# Altium schematic sheet PowerDelivery.SchDoc: PPS, 2.9V rail, U/I sensing
size A4; SheetNumber: 2; SheetTotal: 2
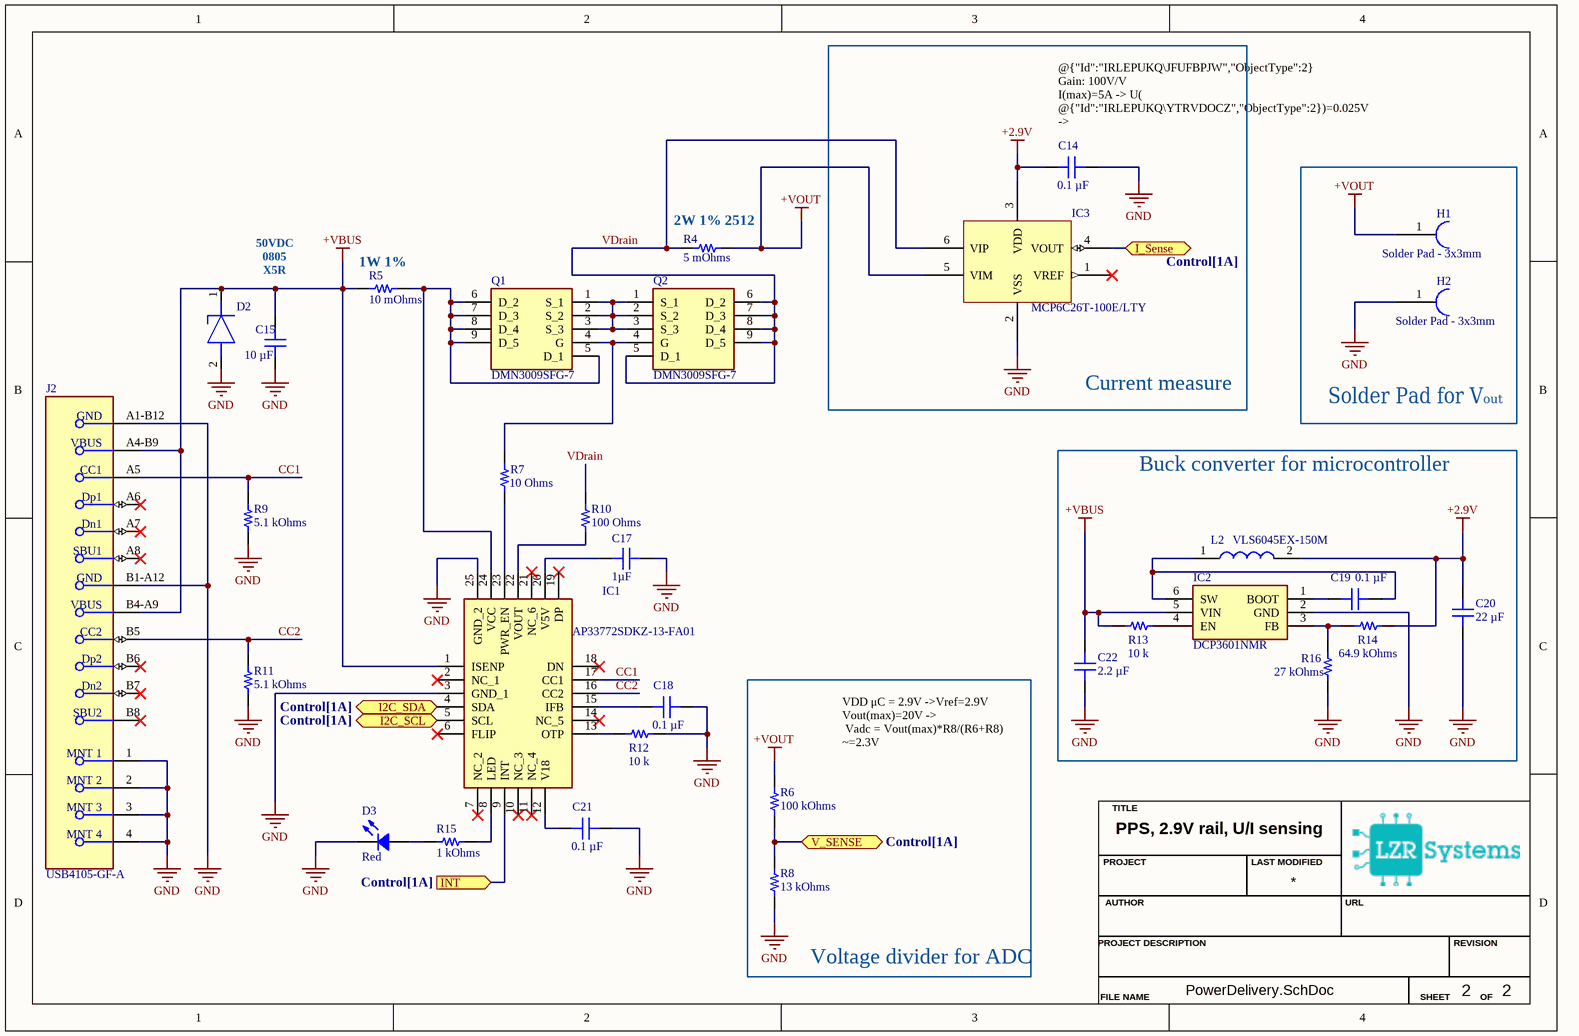
[diagram p0: PowerDelivery.SchDoc]

## Parts
C14  0.1 µF  [CAP 0805_2012]
C15  10 µF  [MURATA GRM21B 0805_2012]
C17  1µF  [CAP 0805_2012]
C18  0.1 µF  [CAP 0805_2012]
C19  0.1 µF  [CAP 0805_2012]
C20  22 µF  [CAP 1206_3216 - 0.8MM]
C21  0.1 µF  [CAP 0805_2012]
C22  2.2 µF  [CAP 1206_3216 - 0.8MM]
D2  PESD24VS1UA,115  [SOD2512X110N]  (value not drawn)
D3  Red  [LED 1206_3216 RED]
H1  Solder Pad - 3x3mm  [Solder Pad - 3x3mm-Footprint-1]
H2  Solder Pad - 3x3mm  [Solder Pad - 3x3mm-Footprint-1]
IC1  AP33772SDKZ-13-FA01  [AP33772SDKZ13FA01]
IC2  DCP3601NMR  [SOT95P280X125-6N]
IC3  MCP6C26T-100E/LTY  [SOT65P210X80-6N]
J2  USB4105-GF-A  [FP-USB4105-GF-A-MFG]
L2  VLS6045EX-150M  [VLS6045]
Q1  DMN3009SFG-7  [DMTH8008LFGQ7]
Q2  DMN3009SFG-7  [DMTH8008LFGQ7]
R4  5 mOhms  [STACKPOLE CSM2512]
R5  10 mOhms  [RES 1206_3216]
R6  100 kOhms  [RES 0805_2012]
R7  10 Ohms  [RES 0805_2012]
R8  13 kOhms  [RES 0805_2012]
R9  5.1 kOhms  [YAGEO RES 0805_2012]
R10  100 Ohms  [RES 0805_2012]
R11  5.1 kOhms  [YAGEO RES 0805_2012]
R12  10 k  [RES 0805_2012]
R13  10 k  [RES 0805_2012]
R14  64.9 kOhms  [RES 0805_2012]
R15  1 kOhms  [RES 0805_2012]
R16  27 kOhms  [YAGEO RES 0805_2012]

## Blocks framed on the sheet
Current measure: C14 IC3
Solder Pad for Vₒᵤₜ: H1 H2
Buck converter for microcontroller: C19 C20 C22 IC2 L2 R13 R14 R16
Voltage divider for ADC: R6 R8

## Ports
I2C_SCL (bidir, see Control[1A]), I2C_SDA (bidir, see Control[1A]), I_Sense (bidir, see Control[1A]), INT (in, see Control[1A]), V_SENSE (bidir, see Control[1A])

## Nets
+2.9V: C14.2 C20.2 IC3.3(VDD) L2.2 R14.2
+VBUS: C15.2 C22.2 D2.1(K) IC1.1(ISENP) IC2.5(VIN) J2.A4-B9(VBUS) J2.B4-A9(VBUS) R5.1 R13.1
+VOUT: H1.1 IC3.5(VIM) R4.2 R6.2
GND: C14.1 C15.1 C17.2 C18.1 C20.1 C21.1 C22.1 D2.2(A) D3.2 H2.1 IC1.3(GND_1) IC1.25(GND_2) IC2.2(GND) IC3.2(VSS) J2.1(MNT_1) J2.2(MNT_2) J2.3(MNT_3) J2.4(MNT_4) J2.A1-B12(GND) J2.B1-A12(GND) R8.1 R9.1 R11.1 R12.2 R16.1
CC1: IC1.17(CC1) J2.A5(CC1) R9.2
CC2: IC1.16(CC2) J2.B5(CC2) R11.2
I2C_SCL: IC1.5(SCL) ; port I2C_SCL
I2C_SDA: IC1.4(SDA) ; port I2C_SDA
I_Sense: IC3.4(VOUT) ; port I_Sense
INT: IC1.9(INT) ; port INT
V_SENSE: R6.1 R8.2 ; port V_SENSE
VDrain: IC3.6(VIP) Q2.5(D_1) Q2.6(D_2) Q2.7(D_3) Q2.8(D_4) Q2.9(D_5) R4.1 R10.2
NetC17_1: C17.1 IC1.20(V5V)
NetC18_2: C18.2 IC1.15(IFB)
NetC19_1: C19.1 IC2.1(BOOT)
NetC19_2: C19.2 IC2.6(SW) L2.1
NetC21_2: C21.2 IC1.12(V18)
NetD3_1: D3.1 R15.1
NetIC1_8: IC1.8(LED) R15.2
NetIC1_13: IC1.13(OTP) R12.1
NetIC1_22: IC1.22(VOUT) R10.1
NetIC1_23: IC1.23(PWR_EN) R7.1
NetIC1_24: IC1.24(VCC) Q1.5(D_1) Q1.6(D_2) Q1.7(D_3) Q1.8(D_4) Q1.9(D_5) R5.2
NetIC2_3: IC2.3(FB) R14.1 R16.2
NetIC2_4: IC2.4(EN) R13.2
NetQ1_1: Q1.1(S_1) Q1.2(S_2) Q1.3(S_3) Q2.1(S_1) Q2.2(S_2) Q2.3(S_3)
NetQ1_4: Q1.4(G) Q2.4(G) R7.2

Not connected (* = marked no-connect by the designer): IC1 2(NC_1)* 6(FLIP)* 7(NC_2)* 10(NC_3)* 11(NC_4)* 14(NC_5)* 18(DN)* 19(DP)* 21(NC_6)*; IC3 1(VREF)*; J2 A6(Dp1)* A7(Dn1)* A8(SBU1)* B6(Dp2)* B7(Dn2)* B8(SBU2)*

## Notes on the sheet
- (near C14) @{"Id":"IRLEPUKQ\JFUFBPJW","ObjectType":2} Gain: 100V/V
  I(max)=5A -> U( @{"Id":"IRLEPUKQ\YTRVDOCZ","ObjectType":2})=0.025V ->
  Uadc(max) = 2.5V
- Type @ to refer to a designator
- (near R4) 2W 1% 2512
- 50VDC
  0805
  X5R
- (near R5) 1W 1%
- VDD μC = 2.9V ->Vref=2.9V
  Vout(max)=20V ->
  Vadc = Vout(max)*R8/(R6+R8) ~=2.3V
- TITLE
- AUTHOR
- PROJECT
- LAST MODIFIED
- URL
- PROJECT DESCRIPTION
- REVISION
- FILE NAME
- SHEET
- OF

## Library data of the parts
C14 C18 C19 C21 = CC0805MRX7R9BB104: CAP CER 0.1UF 50V X7R 0805; manufacturer: Yageo; Tolerance: ±20%; Part Number: CC0805MRX7R9BB104; Capacitance: 0.1 µF; Applications: General Purpose; componentlink1description: Datasheet; componentlink1url: https://www.yageo.com/upload/media/product/productsearch/datasheet/mlcc/UPY-GPHC_X7R_6.3V-to-50V_18.pdf; componentlink2description: DigiKey Link; componentlink2url: https://www.digikey.com/en/products/detail/yageo/CC0805MRX7R9BB104/5884281; Device Package: 0805 (2012 Metric); lastupdated: 2/9/2024 8:16:09 PM; Lifecycle Status: Active; Minimum Order: 1; Mounting Type: Surface Mount, MLCC; Operating Temperature: -55°C ~ 125°C; Package / Case: 0805 (2012 Metric); packaging: TapeAndReel; partid: 2475; Part Status: Active; price: 0.01; series: CC; Size / Dimension: 0.079" L x 0.049" W (2.00mm x 1.25mm); Supplier 1: DigiKey; Supplier Part Number 1: 311-4351-1-ND; Temperature Coefficient: X7R; Thickness (Max): 0.037" (0.95mm); value: 0.1 µF; Voltage - Rated: 50V
C15 = GRM21BR61H106KE43L: CAP CER 10UF 50V X5R 0805; manufacturer: Murata Electronics; Tolerance: ±10%; Part Number: GRM21BR61H106KE43L; Capacitance: 10 µF; Applications: Mobile Devices Only; componentlink1description: Datasheet; componentlink1url: https://search.murata.co.jp/Ceramy/image/img/A01X/G101/ENG/GRM21BR61H106KE43-01A.pdf; componentlink2description: DigiKey Link; componentlink2url: https://www.digikey.com/en/products/detail/murata-electronics/GRM21BR61H106KE43L/10326316; Device Package: 0805 (2012 Metric); lastupdated: 8/27/2024 9:29:56 AM; Lifecycle Status: Active; Minimum Order: 1; Mounting Type: Surface Mount, MLCC; Operating Temperature: -55°C ~ 85°C; Package / Case: 0805 (2012 Metric); packaging: TapeAndReel; partid: 39284; Part Status: Active; price: 0.05; series: GRM; Size / Dimension: 0.079" L x 0.049" W (2.00mm x 1.25mm); Supplier 1: DigiKey; Supplier Part Number 1: 490-18663-1-ND; Temperature Coefficient: X5R; Thickness (Max): 0.057" (1.45mm); value: 10 µF; Voltage - Rated: 50V
C17 = 08053C105KAT2A: CAP CER 1UF 25V X7R 0805; manufacturer: AVX Corporation; Tolerance: ±10%; Part Number: 08053C105KAT2A; Capacitance: 1µF; Applications: General Purpose; componentlink1description: Datasheet; componentlink1url: http://datasheets.avx.com/X7RDielectric.pdf; componentlink2description: DigiKey Link; componentlink2url: http://digikey.com/product-detail/en/avx-corporation/08053C105KAT2A/478-5030-1-ND/1888241; Device Package: 0805 (2012 Metric); lastupdated: 9/2/2020 1:04:33 AM; Lifecycle Status: Active; Minimum Order: 1; Mounting Type: Surface Mount, MLCC; Operating Temperature: -55°C ~ 125°C; Package / Case: 0805 (2012 Metric); packaging: TapeAndReel; partid: 7289; Part Status: Active; price: 0.04; series: -; Size / Dimension: 0.079" L x 0.049" W (2.01mm x 1.25mm); Supplier 1: DigiKey; Supplier Part Number 1: 478-5030-1-ND; Temperature Coefficient: X7R; Thickness (Max): 0.037" (0.94mm); value: 1µF; Voltage - Rated: 25V
C20 = CL31A226MOCLNNC: CAP CER 22UF 16V X5R 1206; manufacturer: Samsung Electro-Mechanics; Tolerance: ±20%; Part Number: CL31A226MOCLNNC; Capacitance: 22 µF; Applications: General Purpose; componentlink1description: Datasheet; componentlink1url: http://www.samsungsem.com/kr/support/product-search/mlcc/CL31A226MOCLNNC.jsp; componentlink2description: DigiKey Link; componentlink2url: https://www.digikey.com/en/products/detail/samsung-electro-mechanics/CL31A226MOCLNNC/3888386; Device Package: 1206 (3216 Metric); Features: Low Profile; lastupdated: 6/4/2024 7:10:40 PM; Lifecycle Status: Active; Minimum Order: 1; Mounting Type: Surface Mount, MLCC; Operating Temperature: -55°C ~ 85°C; Package / Case: 1206 (3216 Metric); packaging: TapeAndReel; partid: 19106; Part Status: Active; price: 0.04; series: CL; Size / Dimension: 0.126" L x 0.063" W (3.20mm x 1.60mm); Supplier 1: DigiKey; Supplier Part Number 1: 1276-2728-1-ND; Temperature Coefficient: X5R; Thickness (Max): 0.037" (0.95mm); value: 22 µF; Voltage - Rated: 16V
C22 = GCJ31CR71H225KA12K: CAP CER 2.2UF 50V X7R 1206; manufacturer: Murata Electronics; Tolerance: ±10%; Part Number: GCJ31CR71H225KA12K; Capacitance: 2.2 µF; Applications: Automotive, Boardflex Sensitive; componentlink1description: Datasheet; componentlink1url: https://search.murata.co.jp/Ceramy/image/img/A01X/G101/ENG/GCJ31CR71H225KA12-01.pdf; componentlink2description: DigiKey Link; componentlink2url: https://www.digikey.com/en/products/detail/murata-electronics/GCJ31CR71H225KA12K/11618649; Device Package: 1206 (3216 Metric); Features: Soft Termination; lastupdated: 6/4/2024 7:10:16 PM; Lifecycle Status: Active; Minimum Order: 1; Mounting Type: Surface Mount, MLCC; Operating Temperature: -55°C ~ 125°C; Package / Case: 1206 (3216 Metric); packaging: TapeAndReel; partid: 30270; Part Status: Active; price: 0.06; Ratings: AEC-Q200; series: GCJ; Size / Dimension: 0.126" L x 0.063" W (3.20mm x 1.60mm); Supplier 1: DigiKey; Supplier Part Number 1: 490-GCJ31CR71H225KA12KCT-ND; Temperature Coefficient: X7R; Thickness (Max): 0.075" (1.90mm); value: 2.2 µF; Voltage - Rated: 50V
D2 = PESD24VS1UA,115: Diode ESD (Uni-directional); Manufacturer_Name: Nexperia; Datasheet Link: https://assets.nexperia.com/documents/data-sheet/PESD24VS1UA.pdf; Height: 1.1mm; Manufacturer_Part_Number: PESD24VS1UA,115; Mouser Part Number: 771-PESD24VS1UA115; Mouser Price/Stock: https://www.mouser.co.uk/ProductDetail/Nexperia/PESD24VS1UA115?qs=A1cBxND5mHKZ%252BhkKKiwSEA%3D%3D; Arrow Part Number: PESD24VS1UA,115; Arrow Price/Stock: https://www.arrow.com/en/products/pesd24vs1ua115/nexperia
D3 = 5990210007F: LED RED 1206 SMD; Manufacturer: Dialight; Configuration: Standard; Current - Test: 20mA; Lens Color: 0.80mm; Lens Size: 2.00mm x 1.60mm; Lens Style: Rectangle with Flat Top; Millicandela Rating: 29mcd; Viewing Angle: 140°; Voltage - Forward (Vf) (Typ): 2.1V; Wavelength - Dominant: 633nm; Part Number: 5990210007F; Color: Red; ComponentLink1Description: Datasheet; ComponentLink1URL: http://www.dialightsignalsandcomponents.com/Assets/Brochures_And_Catalogs/Indication/CBI_SMD_new/Dialight_CBI_data_599-1206_Apr2018.pdf; ComponentLink2Description: DigiKey Link; ComponentLink2URL: https://www.digikey.com/en/products/detail/dialight/5990210007F/9385415; Device Package: 1206 (3216 Metric); Height (Max): 0.80mm; LastUpdated: 6/3/2024 8:00:41 PM; Lifecycle Status: Active; Minimum Order: 1; Mounting Type: Surface Mount; Package / Case: 1206 (3216 Metric); Packaging: TapeAndReel; PartId: 188; Part Status: Active; Price: 0.04; Series: 599; Size / Dimension: 3.20mm L x 1.60mm W; Supplier 1: DigiKey; Supplier Part Number 1: 350-4360-1-ND; Supplier Device Package: 1206; Value: Red
H1 H2 = CMP-002-00073-4: Wire to board solder pad rectangular 3x3mm
IC1 = AP33772SDKZ-13-FA01: Integrated Circuit; Manufacturer_Name: Diodes Incorporated; Datasheet Link: https://www.diodes.com/datasheet/download/AP33772S.pdf; Height: 0.8mm; Manufacturer_Part_Number: AP33772SDKZ-13-FA01; Mouser Part Number: 621-P33772SDKZ13FA01; Mouser Price/Stock: https://www.mouser.co.uk/ProductDetail/Diodes-Incorporated/AP33772SDKZ-13-FA01?qs=2wMNvWM5ZX4CLYQ4%252BLyimw%3D%3D
IC2 = DCP3601NMR: Integrated Circuit; Manufacturer_Name: STMicroelectronics; Datasheet Link: https://www.st.com/resource/en/datasheet/dcp3601.pdf; Height: 1.25mm; Manufacturer_Part_Number: DCP3601NMR; Mouser Part Number: 511-DCP3601NMR; Mouser Price/Stock: https://www.mouser.co.uk/ProductDetail/STMicroelectronics/DCP3601NMR?qs=VVKQmw408U%252BduQkqjRfAvg%3D%3D
IC3 = CMP-014-00006-1: Current Sense Amplifiers Zero-Drift, Current Sense Amplifier, Gain = 100V/V, REEL; Pins: 6
J2 = CMP-002-00071-1: Conn USB 2.0 Type C RCP 24 POS 0.3mm/0.5mm Solder RA SMD 24 Terminal 1 Port T/R
L2 = VLS6045EX-150M: Inductor; Manufacturer_Name: TDK; Datasheet Link: https://product.tdk.com/system/files/dam/doc/product/inductor/inductor/smd/catalog/inductor_commercial_power_vls6045ex_en.pdf; Manufacturer_Part_Number: VLS6045EX-150M; Mouser Part Number: 810-VLS6045EX-150M; Mouser Price/Stock: https://www.mouser.co.uk/ProductDetail/TDK/VLS6045EX-150M?qs=oF%2FSscNnLpDh4m%2FVdQ%2FgKQ%3D%3D; Arrow Part Number: VLS6045EX-150M; Arrow Price/Stock: https://www.arrow.com/en/products/vls6045ex-150m/tdk?region=nac
Q1 Q2 = DMN3009SFG-7: MOSFET (N-Channel); Manufacturer_Name: Diodes Incorporated; Datasheet Link: https://www.diodes.com/datasheet/download/DMN3009SFG.pdf; Height: 0.8mm; Manufacturer_Part_Number: DMN3009SFG-7; Mouser Part Number: 621-DMN3009SFG-7; Mouser Price/Stock: https://www.mouser.co.uk/ProductDetail/Diodes-Incorporated/DMN3009SFG-7?qs=NnBbvHfz1MnfgYcTpHZiGg%3D%3D
R4 = CSM2512FT40L0: RES 0.04 OHM 1% 3W 2512; manufacturer: Stackpole Electronics Inc; Resistance: 40 mOhms; Temperature Coefficient: ±50ppm/°C; value: 40 mOhms; Part Number: CSM2512FT40L0; componentlink1description: Datasheet; componentlink1url: https://www.seielect.com/Catalog/SEI-CSM.PDF; componentlink2description: DigiKey Link; componentlink2url: https://www.digikey.com/en/products/detail/stackpole-electronics-inc/CSM2512FT40L0/13930213; Composition: Metal Element; Device Package: 2512 (6332 Metric); Features: Automotive AEC-Q200, Current Sense; Height - Seated (Max): 0.043" (1.10mm); lastupdated: 6/3/2024 8:27:03 PM; Lifecycle Status: Active; Minimum Order: 1; Number of Terminations: 2; Operating Temperature: -55°C ~ 170°C; Package / Case: 2512 (6332 Metric); packaging: TapeAndReel; Part Status: Active; Power (Watts): 3W; price: 0.19; Ratings: AEC-Q200; series: CSM; Size / Dimension: 0.252" L x 0.126" W (6.40mm x 3.20mm); Supplier 1: DigiKey; Supplier Part Number 1: 738-CSM2512FT40L0CT-ND; Supplier Device Package: 2512; Tolerance: ±1%
R5 = TLRP2B10WR010FTD: RES 0.01 OHM 1% 1W 1206; Manufacturer: TE Connectivity Passive Product; Temperature Coefficient: ±75ppm/°C; Part Number: TLRP2B10WR010FTD; ComponentLink1Description: Datasheet; ComponentLink1URL: https://www.te.com/commerce/DocumentDelivery/DDEController?Action=srchrtrv&DocNm=1773449-4&DocType=DS&DocLang=English; ComponentLink2Description: DigiKey Link; ComponentLink2URL: https://www.digikey.com/en/products/detail/te-connectivity-passive-product/TLRP2B10WR010FTD/14652424; Composition: Metal Element; Device Package: 1206 (3216 Metric); Features: Anti-Sulfur, Automotive AEC-Q200, Current Sense; Height - Seated (Max): 0.026" (0.65mm); LastUpdated: 2/9/2024 8:53:14 PM; Lifecycle Status: Active; Minimum Order: 1; Number of Terminations: 2; Operating Temperature: -55°C ~ 170°C; Package / Case: 1206 (3216 Metric); Packaging: TapeAndReel; PartId: 67637; Part Status: Active; Power (Watts): 1W; Price: 0.13; Ratings: AEC-Q200; Resistance: 10 mOhms; Series: TLRP; Size / Dimension: 0.124" L x 0.057" W (3.15mm x 1.45mm); Supplier 1: DigiKey; Supplier Part Number 1: 1712-TLRP2B10WR010FTDCT-ND; Supplier Device Package: 1206; Tolerance: ±1%; Value: 10 mOhms
R6 = CRCW0805100KFKEA: RES SMD 100K OHM 1% 1/8W 0805; Manufacturer: Vishay Dale; Power (Watts): 0.125W, 1/8W; Temperature Coefficient: ±100ppm/°C; Part Number: CRCW0805100KFKEA; Value: 100 kOhms; ComponentLink1Description: Datasheet; ComponentLink1URL: http://www.vishay.com/docs/20035/dcrcwe3.pdf; ComponentLink2Description: DigiKey Link; ComponentLink2URL: https://www.digikey.com/en/products/detail/vishay-dale/CRCW0805100KFKEA/1175865; Composition: Thick Film; Device Package: 0805 (2012 Metric); Features: Automotive AEC-Q200; Height - Seated (Max): 0.020" (0.50mm); LastUpdated: 2/8/2024 9:02:17 PM; Lifecycle Status: Active; Minimum Order: 1; Number of Terminations: 2; Operating Temperature: -55°C ~ 155°C; Package / Case: 0805 (2012 Metric); Packaging: TapeAndReel; PartId: 32640; Part Status: Active; Price: 0.01; Ratings: AEC-Q200; Resistance: 100 kOhms; Series: CRCW; Size / Dimension: 0.079" L x 0.049" W (2.00mm x 1.25mm); Supplier 1: DigiKey; Supplier Part Number 1: 541-100KCCT-ND; Supplier Device Package: 0805; Tolerance: ±1%
R7 = CRCW080510R0FKEAC: RES 10 OHM 1% 1/8W 0805; Manufacturer: Vishay Dale; Power (Watts): 0.125W, 1/8W; Temperature Coefficient: ±100ppm/°C; Part Number: CRCW080510R0FKEAC; Value: 10 Ohms; ComponentLink1Description: Datasheet; ComponentLink1URL: http://www.vishay.com/docs/28773/crcwce3.pdf; ComponentLink2Description: DigiKey Link; ComponentLink2URL: https://www.digikey.com/en/products/detail/vishay-dale/CRCW080510R0FKEAC/7928554; Composition: Thick Film; Device Package: 0805 (2012 Metric); Height - Seated (Max): 0.024" (0.60mm); LastUpdated: 2/8/2024 9:01:19 PM; Lifecycle Status: Active; Minimum Order: 1; Number of Terminations: 2; Operating Temperature: -55°C ~ 155°C; Package / Case: 0805 (2012 Metric); Packaging: TapeAndReel; PartId: 46232; Part Status: Active; Price: 0.01; Resistance: 10 Ohms; Series: CRCW-C; Size / Dimension: 0.079" L x 0.049" W (2.00mm x 1.25mm); Supplier 1: DigiKey; Supplier Part Number 1: 541-4132-1-ND; Supplier Device Package: 0805; Tolerance: ±1%
R8 = CRCW080511K0FKEAHP: RES SMD 11K OHM 1% 1/2W 0805; Manufacturer: Vishay Dale; Power (Watts): 0.5W, 1/2W; Resistance: 11 kOhms; Temperature Coefficient: ±100ppm/°C; Part Number: CRCW080511K0FKEAHP; Value: 13 kOhms; ComponentLink1Description: Datasheet; ComponentLink1URL: https://www.vishay.com/docs/20043/crcwhpe3.pdf; ComponentLink2Description: DigiKey Link; ComponentLink2URL: https://www.digikey.com/en/products/detail/vishay-dale/CRCW080511K0FKEAHP/2227077; Composition: Thick Film; Device Package: 0805 (2012 Metric); Features: Automotive AEC-Q200, Pulse Withstanding; Height - Seated (Max): 0.020" (0.50mm); LastUpdated: 2/8/2024 9:00:38 PM; Lifecycle Status: Active; Minimum Order: 1; Number of Terminations: 2; Operating Temperature: -55°C ~ 155°C; Package / Case: 0805 (2012 Metric); Packaging: TapeAndReel; PartId: 61644; Part Status: Active; Price: 0.02; Ratings: AEC-Q200; Series: CRCW-HP; Size / Dimension: 0.079" L x 0.049" W (2.00mm x 1.25mm); Supplier 1: DigiKey; Supplier Part Number 1: 541-CRCW080511K0FKEAHPCT-ND; Supplier Device Package: 0805; Tolerance: ±1%
R9 R11 = RT0805BRD075K1L: RES SMD 5.1K OHM 0.1% 1/8W 0805; Manufacturer: Yageo; Power (Watts): 0.125W, 1/8W; Temperature Coefficient: ±25ppm/°C; Part Number: RT0805BRD075K1L; Value: 5.1 kOhms; ComponentLink1Description: Datasheet; ComponentLink1URL: https://www.yageo.com/upload/media/product/productsearch/datasheet/rchip/PYu-RT_1-to-0.01_RoHS_L_11.pdf; ComponentLink2Description: DigiKey Link; ComponentLink2URL: https://www.digikey.com/en/products/detail/yageo/RT0805BRD075K1L/1075977; Composition: Thin Film; Device Package: 0805 (2012 Metric); Height - Seated (Max): 0.024" (0.60mm); LastUpdated: 7/25/2024 9:20:25 AM; Lifecycle Status: Active; Minimum Order: 1; Number of Terminations: 2; Operating Temperature: -55°C ~ 155°C; Package / Case: 0805 (2012 Metric); Packaging: TapeAndReel; PartId: 32968; Part Status: Active; Price: 0.04; Resistance: 5.1 kOhms; Series: RT; Size / Dimension: 0.079" L x 0.049" W (2.00mm x 1.25mm); Supplier 1: DigiKey; Supplier Part Number 1: YAG1938CT-ND; Supplier Device Package: 0805; Tolerance: ±0.1%
R10 = CRCW0805100RFKEAC: RES 100 OHM 1% 1/8W 0805; Manufacturer: Vishay Dale; Power (Watts): 0.125W, 1/8W; Temperature Coefficient: ±100ppm/°C; Part Number: CRCW0805100RFKEAC; Value: 100 Ohms; ComponentLink1Description: Datasheet; ComponentLink1URL: http://www.vishay.com/docs/28773/crcwce3.pdf; ComponentLink2Description: DigiKey Link; ComponentLink2URL: https://www.digikey.com/en/products/detail/vishay-dale/CRCW0805100RFKEAC/7928401; Composition: Thick Film; Device Package: 0805 (2012 Metric); Height - Seated (Max): 0.024" (0.60mm); LastUpdated: 2/8/2024 9:01:05 PM; Lifecycle Status: Active; Minimum Order: 1; Number of Terminations: 2; Operating Temperature: -55°C ~ 155°C; Package / Case: 0805 (2012 Metric); Packaging: TapeAndReel; PartId: 47768; Part Status: Active; Price: 0.01; Resistance: 100 Ohms; Series: CRCW-C; Size / Dimension: 0.079" L x 0.049" W (2.00mm x 1.25mm); Supplier 1: DigiKey; Supplier Part Number 1: 541-3979-1-ND; Supplier Device Package: 0805; Tolerance: ±1%
R12 R13 = RNCS0805BKE10K0: RES 10K OHM 0.1% 1/10W 0805; Manufacturer: Stackpole Electronics Inc; Power (Watts): 0.1W, 1/10W; Resistance: 10 kOhms; Temperature Coefficient: ±25ppm/°C; Part Number: RNCS0805BKE10K0; Value: 10 k; ComponentLink1Description: Datasheet; ComponentLink1URL: https://www.seielect.com/catalog/sei-rncs_rnch.pdf; ComponentLink2Description: DigiKey Link; ComponentLink2URL: https://www.digikey.com/en/products/detail/stackpole-electronics-inc/RNCS0805BKE10K0/1800067; Composition: Thin Film; Device Package: 0805 (2012 Metric); Features: Anti-Corrosive, Automotive AEC-Q200, Moisture Resistant; Height - Seated (Max): 0.026" (0.65mm); LastUpdated: 2/8/2024 9:02:39 PM; Lifecycle Status: Active; Minimum Order: 1; Number of Terminations: 2; Operating Temperature: -55°C ~ 155°C; Package / Case: 0805 (2012 Metric); Packaging: TapeAndReel; PartId: 27713; Part Status: Active; Price: 0.07; Ratings: AEC-Q200; Series: RNCS; Size / Dimension: 0.079" L x 0.049" W (2.00mm x 1.25mm); Supplier 1: DigiKey; Supplier Part Number 1: RNCS0805BKE10K0CT-ND; Supplier Device Package: 0805; Tolerance: ±0.1%
R14 = RMCF0805FT64K9: RES 64.9K OHM 1% 1/8W 0805; Manufacturer: Stackpole Electronics Inc; Power (Watts): 0.125W, 1/8W; Temperature Coefficient: ±100ppm/°C; Part Number: RMCF0805FT64K9; Value: 64.9 kOhms; ComponentLink1Description: Datasheet; ComponentLink1URL: https://www.seielect.com/catalog/sei-packaging.pdf; ComponentLink2Description: DigiKey Link; ComponentLink2URL: https://www.digikey.com/en/products/detail/stackpole-electronics-inc/RMCF0805FT64K9/1713303; Composition: Thick Film; Device Package: 0805 (2012 Metric); Features: Automotive AEC-Q200; Height - Seated (Max): 0.026" (0.65mm); LastUpdated: 2/8/2024 9:01:11 PM; Lifecycle Status: Active; Minimum Order: 1; Number of Terminations: 2; Operating Temperature: -55°C ~ 155°C; Package / Case: 0805 (2012 Metric); Packaging: CutTape; PartId: 47058; Part Status: Active; Price: 0.01; Ratings: AEC-Q200; Resistance: 64.9 kOhms; Series: RMCF; Size / Dimension: 0.079" L x 0.049" W (2.00mm x 1.25mm); Supplier 1: DigiKey; Supplier Part Number 1: 738-RMCF0805FT64K9CT-ND; Supplier Device Package: 0805; Tolerance: ±1%
R15 = Y40221K00000T0R: RES SMD 1K OHM 0.01% 1/5W 0805; Manufacturer: Vishay Foil Resistors (Division of Vishay Precision Group); Power (Watts): 0.2W, 1/5W; Temperature Coefficient: ±0.2ppm/°C; Part Number: Y40221K00000T0R; Value: 1 kOhms; ComponentLink1Description: Datasheet; ComponentLink1URL: http://www.vishaypg.com/docs/63209/FRSM.pdf; ComponentLink2Description: DigiKey Link; ComponentLink2URL: https://www.digikey.com/en/products/detail/vishay-foil-resistors-division-of-vishay-precision-group/Y40221K00000T0R/2640995; Composition: Metal Foil; Device Package: 0805 (2012 Metric); Features: Moisture Resistant, Non-Inductive; Height - Seated (Max): 0.025" (0.64mm); LastUpdated: 2/8/2024 9:02:07 PM; Lifecycle Status: Active; Minimum Order: 1; Number of Terminations: 2; Operating Temperature: -55°C ~ 150°C; Package / Case: 0805 (2012 Metric); Packaging: TapeAndReel; PartId: 34935; Part Status: Active; Price: 12.16; Resistance: 1 kOhms; Series: FRSM; Size / Dimension: 0.080" L x 0.050" W (2.03mm x 1.27mm); Supplier 1: DigiKey; Supplier Part Number 1: Y4022-1.0KBCT-ND; Supplier Device Package: 0805; Tolerance: ±0.01%
R16 = AC0805JR-0727KL: RES SMD 27K OHM 5% 1/8W 0805; Manufacturer: Yageo; Power (Watts): 0.125W, 1/8W; Temperature Coefficient: ±100ppm/°C; Part Number: AC0805JR-0727KL; Value: 27 kOhms; ComponentLink1Description: Datasheet; ComponentLink1URL: https://www.yageo.com/upload/media/product/productsearch/datasheet/rchip/PYu-AC_51_RoHS_L_10.pdf; ComponentLink2Description: DigiKey Link; ComponentLink2URL: https://www.digikey.com/en/products/detail/yageo/AC0805JR-0727KL/5897103; Composition: Thick Film; Device Package: 0805 (2012 Metric); Features: Automotive AEC-Q200, Moisture Resistant; Height - Seated (Max): 0.024" (0.60mm); LastUpdated: 7/25/2024 9:20:06 AM; Lifecycle Status: Active; Minimum Order: 1; Number of Terminations: 2; Operating Temperature: -55°C ~ 155°C; Package / Case: 0805 (2012 Metric); Packaging: TapeAndReel; PartId: 84032; Price: 0.01; Ratings: AEC-Q200; Resistance: 27 kOhms; Series: AC; Size / Dimension: 0.079" L x 0.049" W (2.00mm x 1.25mm); Supplier 1: DigiKey; Supplier Part Number 1: 13-AC0805JR-0727KLCT-ND; Supplier Device Package: 0805; Tolerance: ±5%